# Altium schematic sheet ROV_MainBoard V2.0.SchDoc: ROV_MainBoard
size A4; Date: 2019.4.6; ApprovedBy: 10; CheckedBy: 淹死的鱼; Author: 淹死的鱼; CompanyName: 9; DrawnBy: 淹死的鱼; Engineer: 淹死的鱼; Organization: 5; Address1: ROV; Address2: V1.0; Address4: 12; DocumentNumber: V1.1; Revision: 3; SheetNumber: 2; SheetTotal: 1; CurrentTime: 2019.4.6; CurrentDate: 2019.4.6; Time: 2019.4.6; DocumentFullPathAndName: 8; DocumentName: 7; ModifiedDate: 6; ImagePath: C:\Users\zengwangfa\Pictures\Saved Pictures\电协logo重绘（10000像素版）.png; ProjectName: 4; Application_BuildNumber: 11
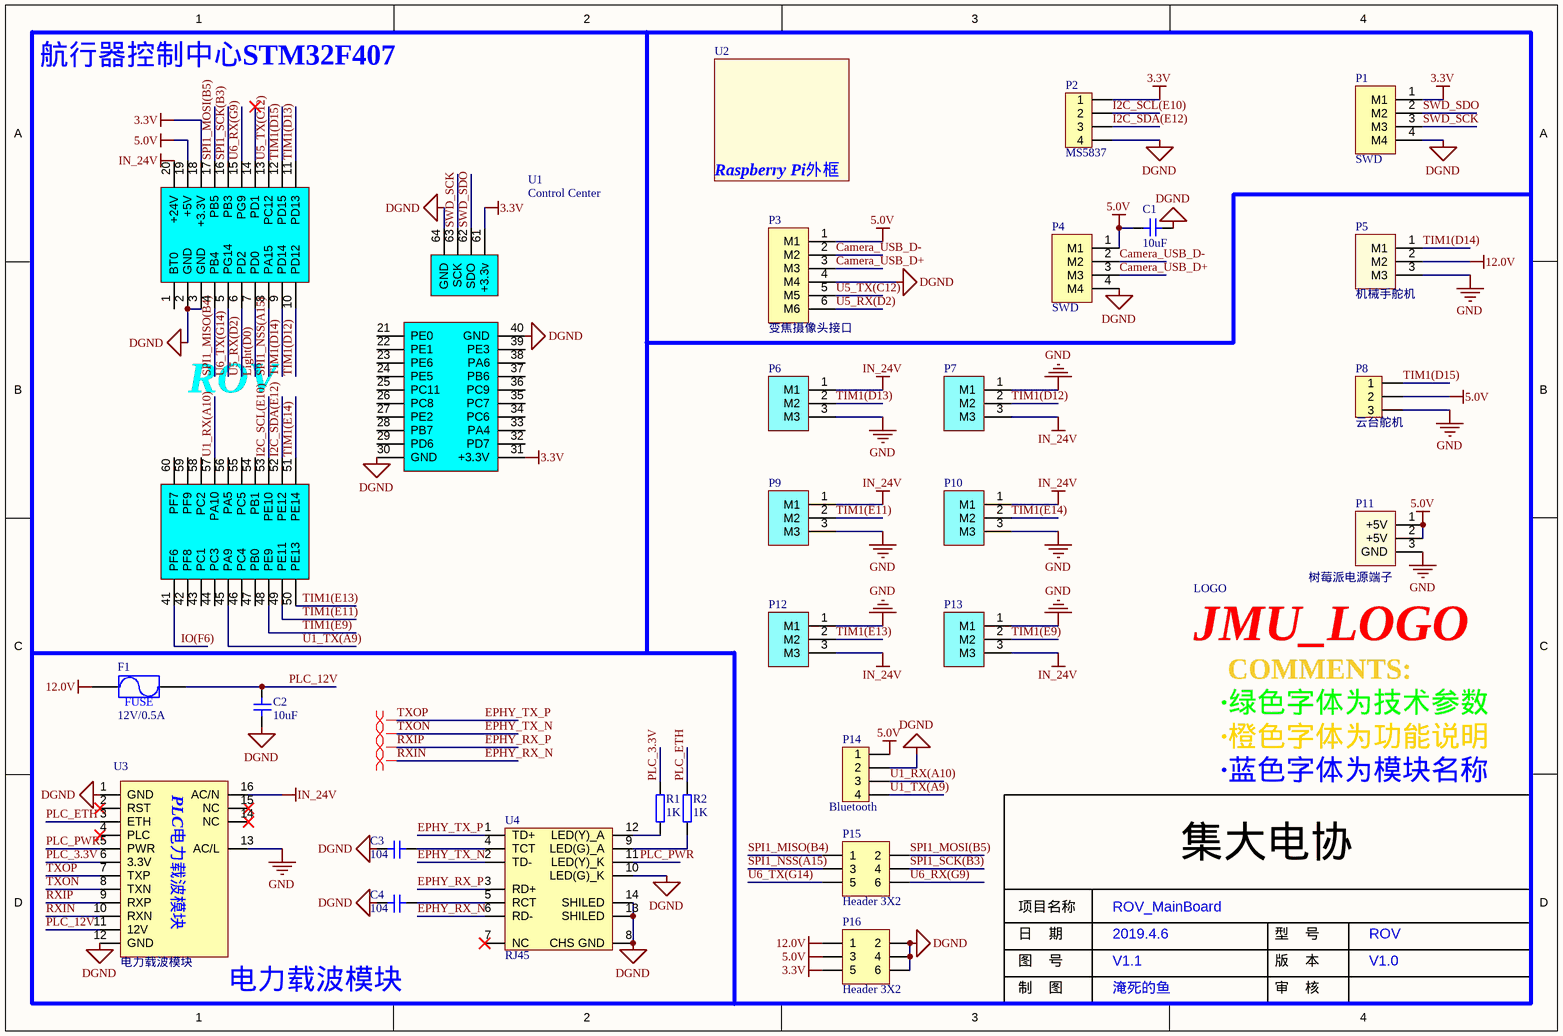
[diagram p0: ROV_MainBoard V2.0.SchDoc]

## Parts
C1  10uF  [0805C]
C2  10uF  [1206C]
C3  104  [0805C]
C4  104  [0805C]
F1  12V/0.5A  [FUSE-1206]
LOGO  (no value)  [JMU_LOGO(1.35cm)]
P1  SWD  [XH4/2.54mm/180]
P2  MS5837  [MX1.25-4PIN]
P3  变焦摄像头接口  [XH6/2.54mm/180]
P4  SWD  [XH4/2.54mm/180]
P5  机械手舵机  [KF128-3P]
P6  (no value)  [KF2EDGK5.0-3P]
P7  (no value)  [KF2EDGK5.0-3P]
P8  云台舵机  [HEADER 3H]
P9  (no value)  [KF2EDGK5.0-3P]
P10  (no value)  [KF2EDGK5.0-3P]
P11  树莓派电源端子  [XH3/2.54mm/180]
P12  (no value)  [KF2EDGK5.0-3P]
P13  (no value)  [KF2EDGK5.0-3P]
P14  Bluetooth  [Header 4(排母)]
P15  Header 3X2  [Header 3X2]
P16  Header 3X2  [Header 3X2]
R1  1K  [0805R]
R2  1K  [0805R]
U1  Control Center  [ROV_Control]
U2  (no value)  [Raspberry Pi]
U3  电力载波模块  [电力载波模块6410]
U4  RJ45  [RJ45]

## Nets
3.3V: P1.1(M1) P2.1 P16.5 U1.18(+3.3V) U1.31(+3.3V) U1.61(+3.3v)
5.0V: C1.2 P3.1(M1) P4.1(M1) P8.2 P11.1(+5V) P11.2(+5V) P14.1 P16.3 U1.19(+5V)
12.0V: F1.1 P5.2(M2) P16.1
DGND: C1.1 C2.1 C3.1 C4.1 P1.4(M4) P2.4 P3.4(M4) P4.4(M4) P14.2 P16.2 P16.4 P16.6 U1.2(GND) U1.3(GND) U1.30(GND) U1.40(GND) U1.64(GND) U3.1(GND) U3.12(GND) U4.8(CHS_GND) U4.10(LED(G)_K) U4.13(SHILED) U4.14(SHILED)
GND: P5.3(M3) P6.3(M3) P7.1(M1) P8.3 P9.3(M3) P10.3(M3) P11.3(GND) P12.1(M1) P13.1(M1) U3.13(AC/L)
IN_24V: P6.1(M1) P7.3(M3) P9.1(M1) P10.1(M1) P12.3(M3) P13.3(M3) U1.20(+24V) U3.16(AC/N)
Camera_USB_D+: P3.3(M3) P4.3(M3)
Camera_USB_D-: P3.2(M2) P4.2(M2)
EPHY_RX_N: U3.10(RXN) U4.6(RD-)  [also labelled RXIN]
EPHY_RX_P: U3.9(RXP) U4.3(RD+)  [also labelled RXIP]
EPHY_TX_N: U3.8(TXN) U4.2(TD-)  [also labelled TXON]
EPHY_TX_P: U3.7(TXP) U4.1(TD+)  [also labelled TXOP]
I2C_SCL(E10): P2.2 U1.53(PE10)
I2C_SDA(E12): P2.3 U1.52(PE12)
IO(F6): U1.41(PF6)
Light(D0): U1.7(PD0)
PLC_3.3V: R1.2 U3.6(3.3V)
PLC_12V: C2.2 F1.2 U3.11(12V)
PLC_ETH: R2.1 U3.3(ETH)
PLC_PWR: U3.5(PWR) U4.11(LED(Y)_K)
SPI1_MISO(B4): P15.1 U1.4(PB4)
SPI1_MOSI(B5): P15.2 U1.17(PB5)
SPI1_NSS(A15): P15.3 U1.8(PA15)
SPI1_SCK(B3): P15.4 U1.16(PB3)
SWD_SCK: P1.3(M3) U1.63(SCK)
SWD_SDO: P1.2(M2) U1.62(SDO)
TIM1(D12): P7.2(M2) U1.10(PD12)
TIM1(D13): P6.2(M2) U1.11(PD13)
TIM1(D14): P5.1(M1) U1.9(PD14)
TIM1(D15): P8.1 U1.12(PD15)
TIM1(E9): P13.2(M2) U1.48(PE9)
TIM1(E11): P9.2(M2) U1.49(PE11)
TIM1(E13): P12.2(M2) U1.50(PE13)
TIM1(E14): P10.2(M2) U1.51(PE14)
U1_RX(A10): P14.3 U1.57(PA10)
U1_TX(A9): P14.4 U1.45(PA9)
U5_RX(D2): P3.6(M6) U1.6(PD2)
U5_TX(C12): P3.5(M5) U1.13(PC12)
U6_RX(G9): P15.6 U1.15(PG9)
U6_TX(G14): P15.5 U1.5(PG14)
NetC3_2: C3.2 U4.4(TCT)
NetC4_2: C4.2 U4.5(RCT)
NetR1_1: R1.1 U4.12(LED(Y)_A)
NetR2_2: R2.2 U4.9(LED(G)_A)

Not connected (* = marked no-connect by the designer): U1 1(BT0) 14(PD1)* 21(PE0) 22(PE1) 23(PE6) 24(PE5) 25(PC11) 26(PC8) 27(PE2) 28(PB7) 29(PD6) 32(PD7) 33(PA4) 34(PC6) 35(PC7) 36(PC9) 37(PB6) 38(PA6) 39(PE3) 42(PF8) 43(PC1) 44(PC3) 46(PC4) 47(PB0) 54(PB1) 55(PC5) 56(PA5) 58(PC2) 59(PF9) 60(PF7); U3 2(RST)* 4(PLC)* 14(NC)* 15(NC)*; U4 7(NC)*

## Layout directives
differential pair: EPHY_RX_N, EPHY_RX_P, EPHY_TX_N, EPHY_TX_P

## Notes on the sheet
- 航行器控制中心STM32F407
- ·绿色字体为技术参数
- COMMENTS:
- ·橙色字体为功能说明
- ·蓝色字体为模块名称
- (near U3) 电力载波模块
- 集大电协
- 项目名称
- 日    期
- 图    号
- 版    本
- 型    号
- 制    图
- 审    核
- (in symbol Fuse) FUSE
- (in symbol Raspberry Pi 外框) Raspberry Pi外框
- (in symbol ROV_Controler) ROV
- (in symbol 电力载波模块6410) PLC电力载波模块

## Library data of the parts
C1-C4 = Cap1: 无极贴片电容
F1 = Fuse: 保险丝
LOGO = JMU_LOGO: LOGO
P1 P4 = 接线端子-4PIN: 4PIN
P2 P14 = Header 4: 排针
P3 = 接线端子-6PIN: 6PIN
P5-P7 P9-P13 = 接线端子-3PIN: 3PIN
P8 = Header 3: 排针
P15 P16 = Header 3X2: 双排排针
R1 R2 = Res: 电阻
U1 = ROV_Controler
U2 = Raspberry Pi 外框
U3 = 电力载波模块6410